# EAGLE schematic schichor_BP_schema (EAGLE 9.6.2)
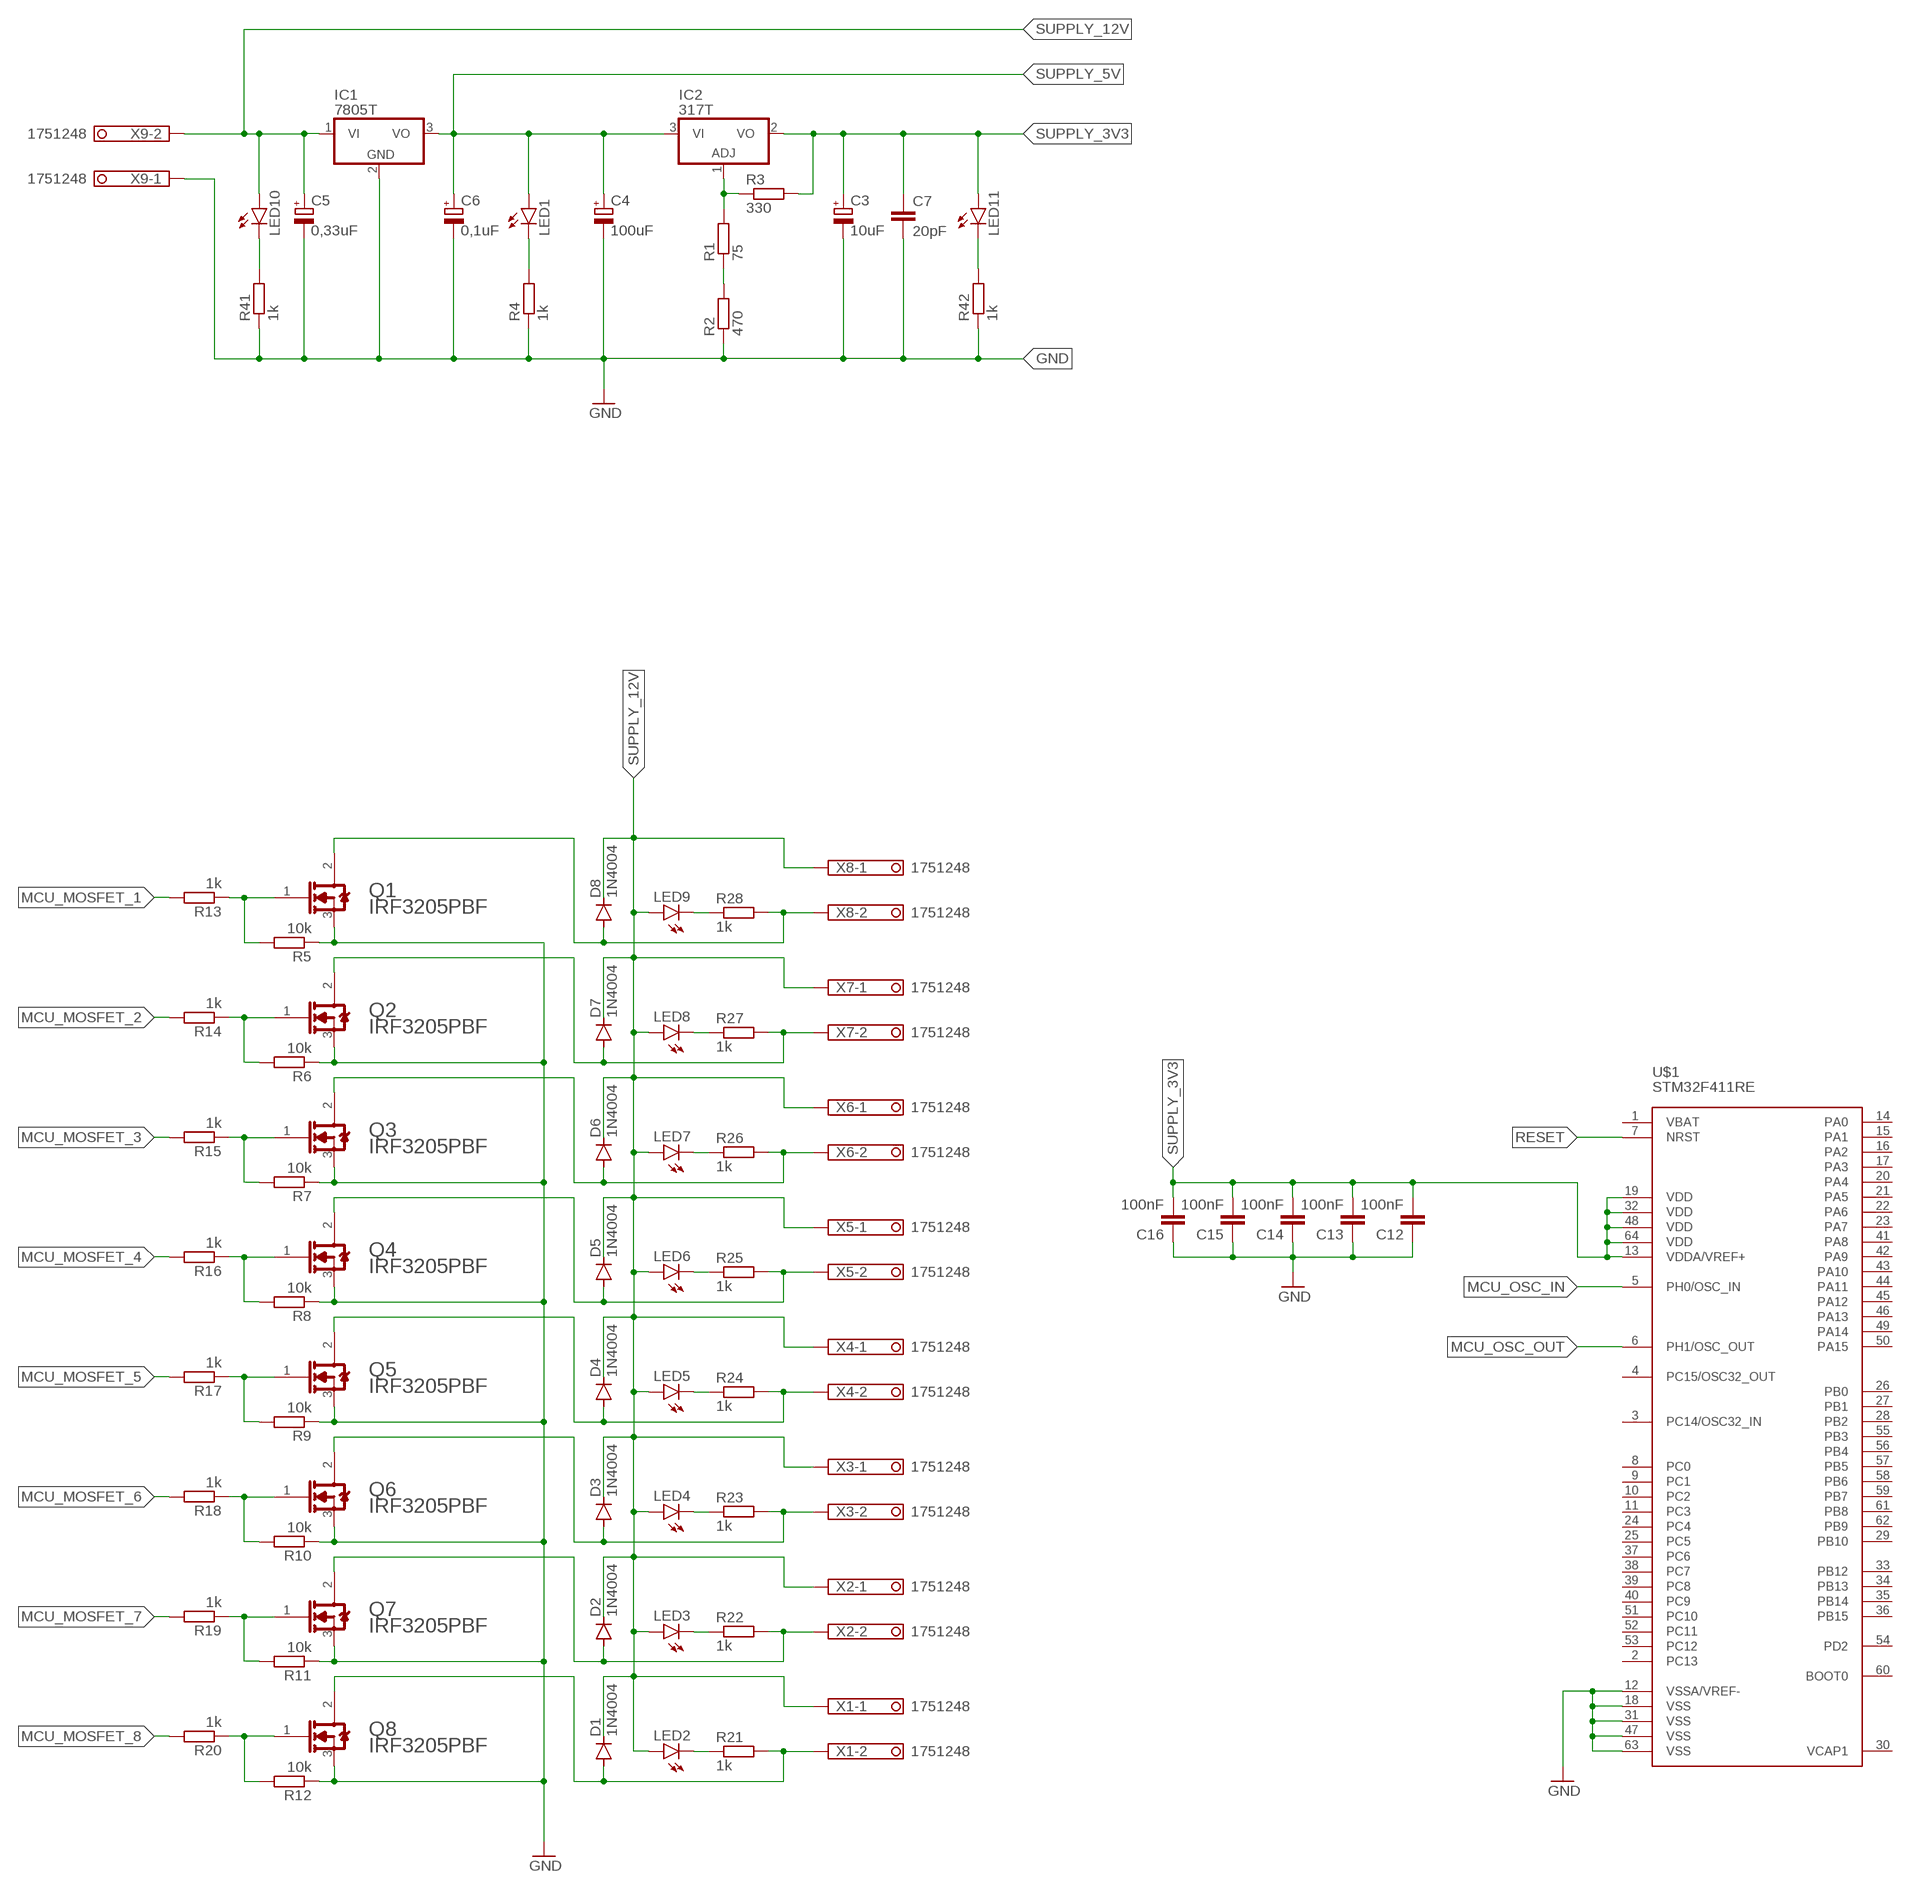
[diagram p0: schematic, sheet 1, part 1 of 2]
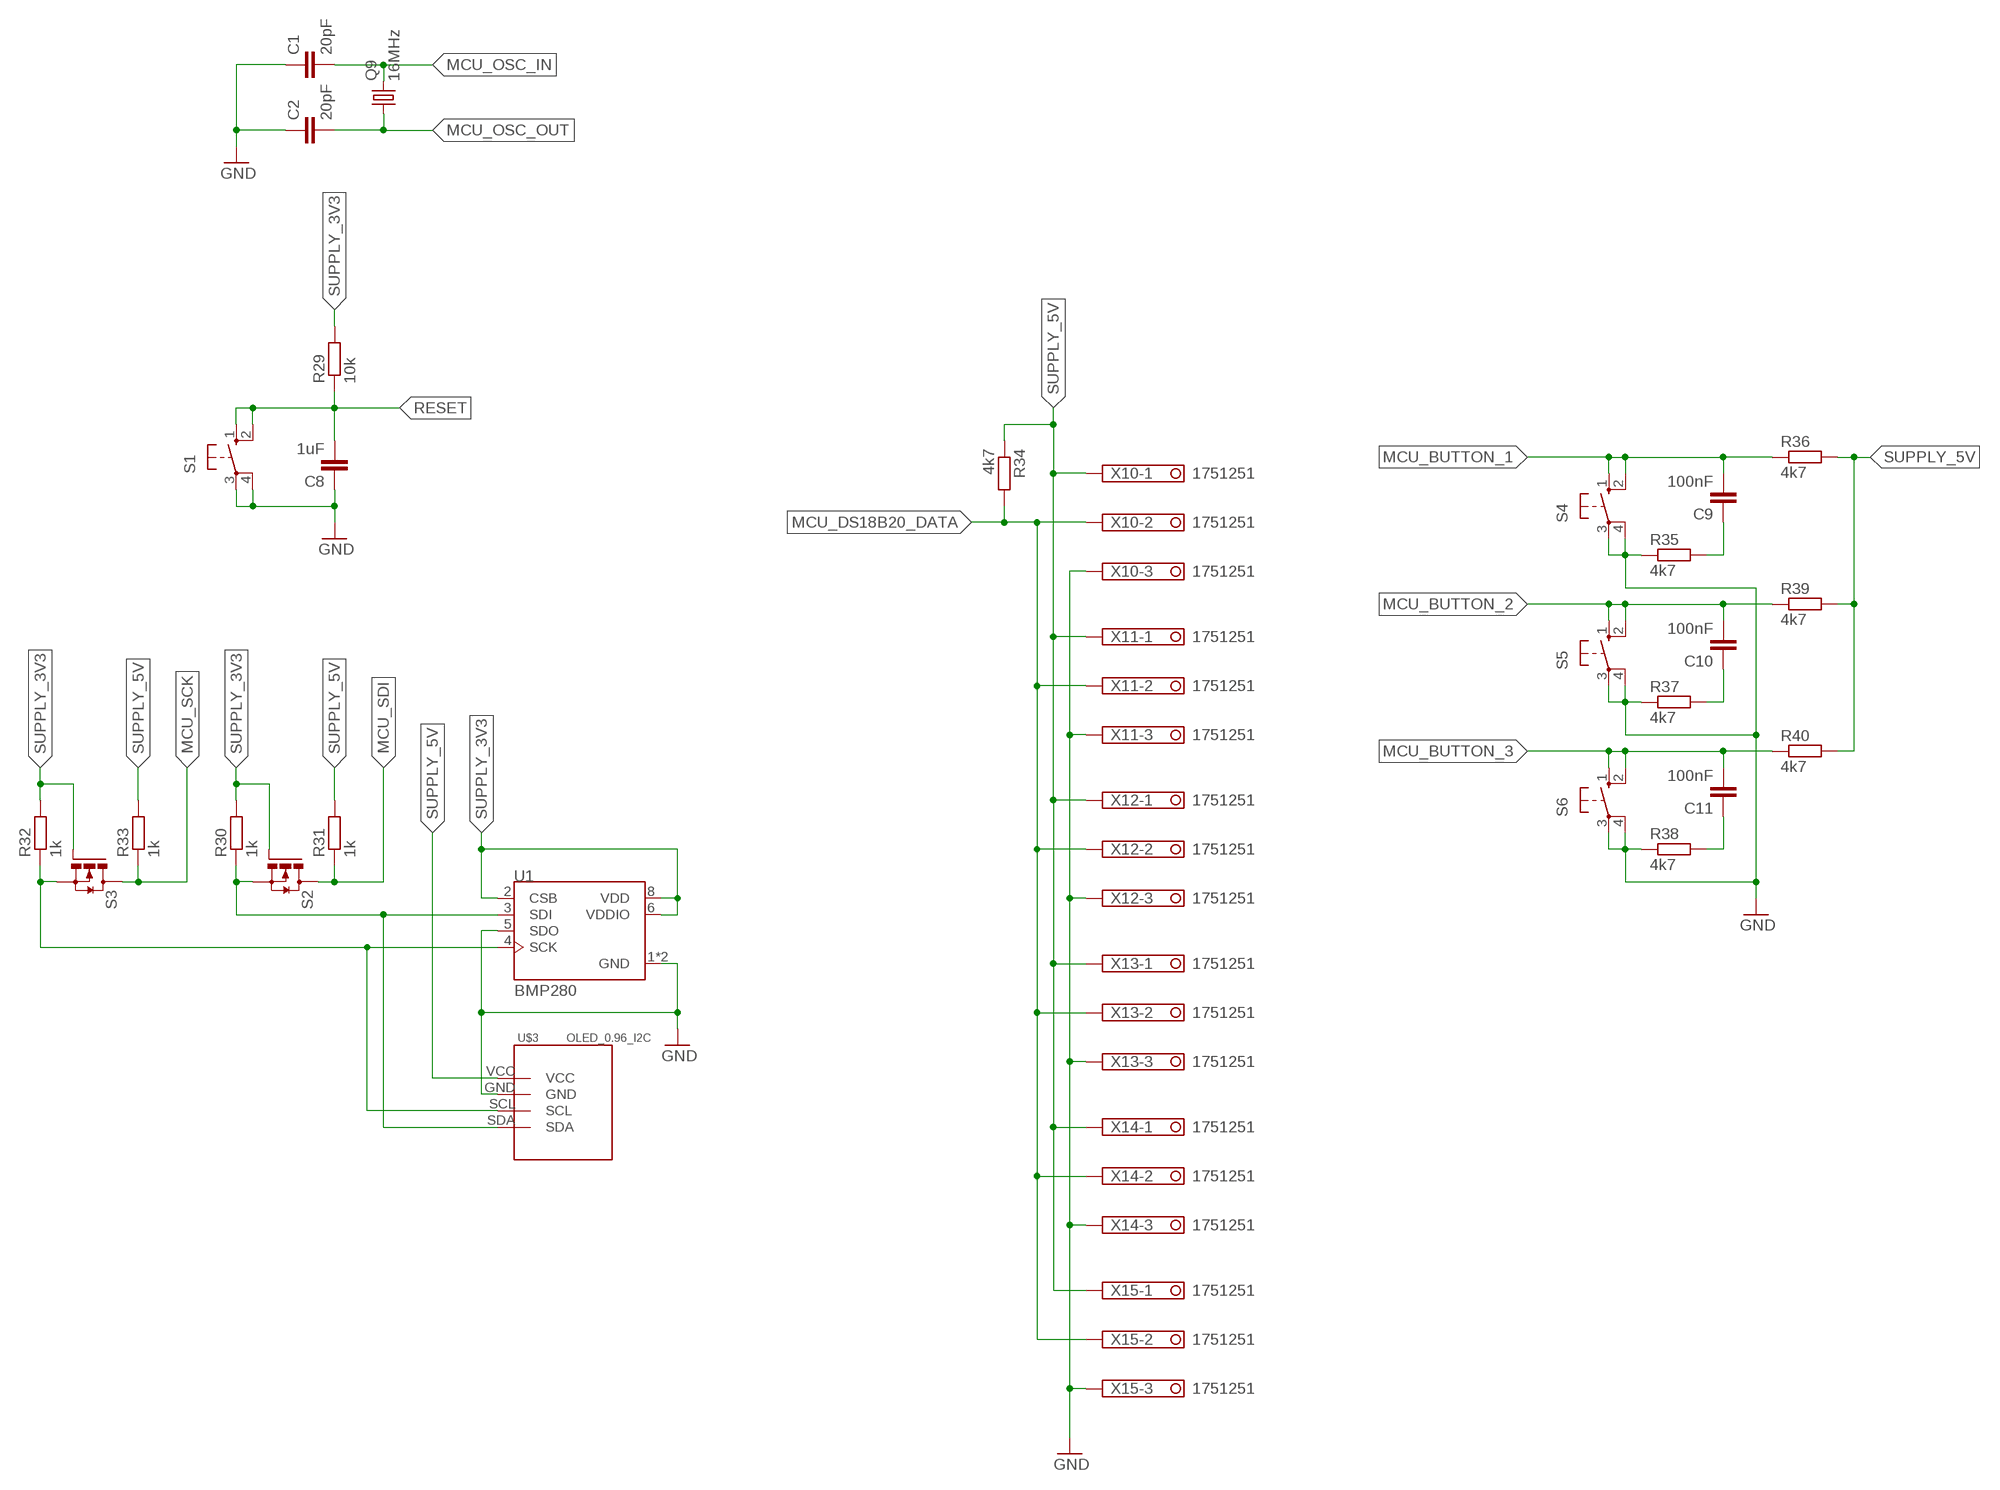
[diagram p1: schematic, sheet 1, part 2 of 2]

## Parts
C1  20pF  C-EUC0201  [C0201]
C2  20pF  C-EUC0201  [C0201]
C3  10uF  CPOL-EU085CS-1AR  [085CS_1AR]
C4  100uF  CPOL-EU085CS-1AR  [085CS_1AR]
C5  0,33uF  CPOL-EU085CS-1AR  [085CS_1AR]
C6  0,1uF  CPOL-EU085CS-1AR  [085CS_1AR]
C7  20pF  C-EUC0201  [C0201]
C8  1uF  C-EUC0201  [C0201]
C9  100nF  C-EUC0201  [C0201]
C10  100nF  C-EUC0201  [C0201]
C11  100nF  C-EUC0201  [C0201]
C12  100nF  C-EUC0201  [C0201]
C13  100nF  C-EUC0201  [C0201]
C14  100nF  C-EUC0201  [C0201]
C15  100nF  C-EUC0201  [C0201]
C16  100nF  C-EUC0201  [C0201]
D1  1N4004  [DO41-10]
D2  1N4004  [DO41-10]
D3  1N4004  [DO41-10]
D4  1N4004  [DO41-10]
D5  1N4004  [DO41-10]
D6  1N4004  [DO41-10]
D7  1N4004  [DO41-10]
D8  1N4004  [DO41-10]
IC1  7805T  [TO220H]
IC2  317T  [TO220H]
LED1  LED  [SMARTLED-TTW]
LED2  LED  [SMARTLED-TTW]
LED3  LED  [SMARTLED-TTW]
LED4  LED  [SMARTLED-TTW]
LED5  LED  [SMARTLED-TTW]
LED6  LED  [SMARTLED-TTW]
LED7  LED  [SMARTLED-TTW]
LED8  LED  [SMARTLED-TTW]
LED9  LED  [SMARTLED-TTW]
LED10  LED  [SMARTLED-TTW]
LED11  LED  [SMARTLED-TTW]
Q1  INFINEON_IRF3205PBFINFINEON_IRF3205PBF_0_0  [INFINEON_IRF3205PBF_0]
Q2  INFINEON_IRF3205PBFINFINEON_IRF3205PBF_0_0  [INFINEON_IRF3205PBF_0]
Q3  INFINEON_IRF3205PBFINFINEON_IRF3205PBF_0_0  [INFINEON_IRF3205PBF_0]
Q4  INFINEON_IRF3205PBFINFINEON_IRF3205PBF_0_0  [INFINEON_IRF3205PBF_0]
Q5  INFINEON_IRF3205PBFINFINEON_IRF3205PBF_0_0  [INFINEON_IRF3205PBF_0]
Q6  INFINEON_IRF3205PBFINFINEON_IRF3205PBF_0_0  [INFINEON_IRF3205PBF_0]
Q7  INFINEON_IRF3205PBFINFINEON_IRF3205PBF_0_0  [INFINEON_IRF3205PBF_0]
Q8  INFINEON_IRF3205PBFINFINEON_IRF3205PBF_0_0  [INFINEON_IRF3205PBF_0]
Q9  16MHz  CRYSTALHC49S  [HC49/S]
R1  75  R-EU_R1206  [R1206]
R2  470  R-EU_R1206  [R1206]
R3  330  R-EU_R1206  [R1206]
R4  1k  R-EU_R1206  [R1206]
R5  10k  R-EU_R1206  [R1206]
R6  10k  R-EU_R1206  [R1206]
R7  10k  R-EU_R1206  [R1206]
R8  10k  R-EU_R1206  [R1206]
R9  10k  R-EU_R1206  [R1206]
R10  10k  R-EU_R1206  [R1206]
R11  10k  R-EU_R1206  [R1206]
R12  10k  R-EU_R1206  [R1206]
R13  1k  R-EU_R1206  [R1206]
R14  1k  R-EU_R1206  [R1206]
R15  1k  R-EU_R1206  [R1206]
R16  1k  R-EU_R1206  [R1206]
R17  1k  R-EU_R1206  [R1206]
R18  1k  R-EU_R1206  [R1206]
R19  1k  R-EU_R1206  [R1206]
R20  1k  R-EU_R1206  [R1206]
R21  1k  R-EU_R1206  [R1206]
R22  1k  R-EU_R1206  [R1206]
R23  1k  R-EU_R1206  [R1206]
R24  1k  R-EU_R1206  [R1206]
R25  1k  R-EU_R1206  [R1206]
R26  1k  R-EU_R1206  [R1206]
R27  1k  R-EU_R1206  [R1206]
R28  1k  R-EU_R1206  [R1206]
R29  10k  R-EU_R1206  [R1206]
R30  1k  R-EU_R1206  [R1206]
R31  1k  R-EU_R1206  [R1206]
R32  1k  R-EU_R1206  [R1206]
R33  1k  R-EU_R1206  [R1206]
R34  4k7  R-EU_R1206  [R1206]
R35  4k7  R-EU_R1206  [R1206]
R36  4k7  R-EU_R1206  [R1206]
R37  4k7  R-EU_R1206  [R1206]
R38  4k7  R-EU_R1206  [R1206]
R39  4k7  R-EU_R1206  [R1206]
R40  4k7  R-EU_R1206  [R1206]
R41  1k  R-EU_R1206  [R1206]
R42  1k  R-EU_R1206  [R1206]
S1  10-XX  [B3F-10XX]
S2  2N7000  [TO-92EXPANDED]
S3  2N7000  [TO-92EXPANDED]
S4  10-XX  [B3F-10XX]
S5  10-XX  [B3F-10XX]
S6  10-XX  [B3F-10XX]
U1  BMP280  [XDCR_BMP280]
U$1  STM32F411RE  STM32F411XC  [LQFP64]
U$3  OLED_0.96_I2C  [OLED_0.96_I2C]
X1  1751248  [1751248]
X2  1751248  [1751248]
X3  1751248  [1751248]
X4  1751248  [1751248]
X5  1751248  [1751248]
X6  1751248  [1751248]
X7  1751248  [1751248]
X8  1751248  [1751248]
X9  1751248  [1751248]
X10  1751251  [1751251]
X11  1751251  [1751251]
X12  1751251  [1751251]
X13  1751251  [1751251]
X14  1751251  [1751251]
X15  1751251  [1751251]

## Nets
GND: C1.1 C2.1 C3.- C4.- C5.- C6.- C7.2 C8.1 C12.1 C13.1 C14.1 C15.1 C16.1 IC1.2(GND) Q1.3(SOURCE) Q2.3(SOURCE) Q3.3(SOURCE) Q4.3(SOURCE) Q5.3(SOURCE) Q6.3(SOURCE) Q7.3(SOURCE) Q8.3(SOURCE) R2.1 R4.1 R5.1 R6.1 R7.1 R8.1 R9.1 R10.1 R11.1 R12.1 R35.1 R37.1 R38.1 R41.1 R42.1 S1.3(P) S1.4(P1) S4.3(P) S4.4(P1) S5.3(P) S5.4(P1) S6.3(P) S6.4(P1) U1.1(GND) U1.5(SDO) U1.7(GND) U$1.12(VSSA/VREF-) U$1.18(VSS) U$1.31(VSS) U$1.47(VSS) U$1.63(VSS) U$3.GND X9.1 X10.3 X11.3 X12.3 X13.3 X14.3 X15.3
MCU_BUTTON_1: C9.2 R36.1 S4.1(S) S4.2(S1)
MCU_BUTTON_2: C10.2 R39.1 S5.1(S) S5.2(S1)
MCU_BUTTON_3: C11.2 R40.1 S6.1(S) S6.2(S1)
MCU_DS18B20_DATA: R34.2 X10.2 X11.2 X12.2 X13.2 X14.2 X15.2
MCU_MOSFET_1: R13.2
MCU_MOSFET_2: R14.2
MCU_MOSFET_3: R15.2
MCU_MOSFET_4: R16.2
MCU_MOSFET_5: R17.2
MCU_MOSFET_6: R18.2
MCU_MOSFET_7: R19.2
MCU_MOSFET_8: R20.2
MCU_OSC_IN: C1.2 Q9.2 U$1.5(PH0/OSC_IN)
MCU_OSC_OUT: C2.2 Q9.1 U$1.6(PH1/OSC_OUT)
MCU_SCK: R33.1 S3.1(D)
MCU_SDI: R31.1 S2.1(D)
N$1: R30.1 S2.3(S) U1.3(SDI) U$3.SDA
N$2: R32.1 S3.3(S) U1.4(SCK) U$3.SCL
N$4: LED10.C@1(C) R41.2
N$5: IC2.1(ADJ) R1.2 R3.1
N$6: C9.1 R35.2
N$7: LED11.C@1(C) R42.2
N$8: LED1.C@1(C) R4.2
N$9: Q1.1(GATE) R5.2 R13.1
N$10: R1.1 R2.2
N$11: Q8.1(GATE) R12.2 R20.1
N$12: Q7.1(GATE) R11.2 R19.1
N$13: Q6.1(GATE) R10.2 R18.1
N$14: Q5.1(GATE) R9.2 R17.1
N$15: Q4.1(GATE) R8.2 R16.1
N$16: Q2.1(GATE) R6.2 R14.1
N$17: Q3.1(GATE) R7.2 R15.1
N$18: D1.A Q8.2(DRAIN) R21.2 X1.2
N$19: D2.A Q7.2(DRAIN) R22.2 X2.2
N$20: LED2.C@1(C) R21.1
N$21: C10.1 R37.2
N$22: LED3.C@1(C) R22.1
N$24: D3.A Q6.2(DRAIN) R23.2 X3.2
N$25: LED4.C@1(C) R23.1
N$26: C11.1 R38.2
N$27: D4.A Q5.2(DRAIN) R24.2 X4.2
N$28: LED5.C@1(C) R24.1
N$30: D5.A Q4.2(DRAIN) R25.2 X5.2
N$31: LED6.C@1(C) R25.1
N$33: D6.A Q3.2(DRAIN) R26.2 X6.2
N$34: LED7.C@1(C) R26.1
N$36: D7.A Q2.2(DRAIN) R27.2 X7.2
N$37: LED8.C@1(C) R27.1
N$39: D8.A Q1.2(DRAIN) R28.2 X8.2
N$40: LED9.C@1(C) R28.1
RESET: C8.2 R29.1 S1.1(S) S1.2(S1) U$1.7(NRST)
SUPPLY_3V3: C3.+ C7.1 C12.2 C13.2 C14.2 C15.2 C16.2 IC2.2(VO) LED11.A@1(A) R3.2 R29.2 R30.2 R32.2 S2.2(G) S3.2(G) U1.2(CSB) U1.6(VDDIO) U1.8(VDD) U$1.13(VDDA/VREF+) U$1.19(VDD) U$1.32(VDD) U$1.48(VDD) U$1.64(VDD)
SUPPLY_5V: C4.+ C6.+ IC1.3(VO) IC2.3(VI) LED1.A@1(A) R31.2 R33.2 R34.1 R36.2 R39.2 R40.2 U$3.VCC X10.1 X11.1 X12.1 X13.1 X14.1 X15.1
SUPPLY_12V: C5.+ D1.C D2.C D3.C D4.C D5.C D6.C D7.C D8.C IC1.1(VI) LED2.A@1(A) LED3.A@1(A) LED4.A@1(A) LED5.A@1(A) LED6.A@1(A) LED7.A@1(A) LED8.A@1(A) LED9.A@1(A) LED10.A@1(A) X1.1 X2.1 X3.1 X4.1 X5.1 X6.1 X7.1 X8.1 X9.2
Unconnected: U$1.1(VBAT) U$1.2(PC13) U$1.3(PC14/OSC32_IN) U$1.4(PC15/OSC32_OUT) U$1.8(PC0) U$1.9(PC1) U$1.10(PC2) U$1.11(PC3) U$1.14(PA0) U$1.15(PA1) U$1.16(PA2) U$1.17(PA3) U$1.20(PA4) U$1.21(PA5) U$1.22(PA6) U$1.23(PA7) U$1.24(PC4) U$1.25(PC5) U$1.26(PB0) U$1.27(PB1) U$1.28(PB2) U$1.29(PB10) U$1.30(VCAP1) U$1.33(PB12) U$1.34(PB13) U$1.35(PB14) U$1.36(PB15) U$1.37(PC6) U$1.38(PC7) U$1.39(PC8) U$1.40(PC9) U$1.41(PA8) U$1.42(PA9) U$1.43(PA10) U$1.44(PA11) U$1.45(PA12) U$1.46(PA13) U$1.49(PA14) U$1.50(PA15) U$1.51(PC10) U$1.52(PC11) U$1.53(PC12) U$1.54(PD2) U$1.55(PB3) U$1.56(PB4) U$1.57(PB5) U$1.58(PB6) U$1.59(PB7) U$1.60(BOOT0) U$1.61(PB8) U$1.62(PB9)

## Library data of the parts
C1 C2 C7-C16 = rcl:C-EU: CAPACITOR, European symbol; SPICEPREFIX: C
C3-C6 = rcl:CPOL-EU: POLARIZED CAPACITOR, European symbol; SPICEPREFIX: C
D1-D8 = diode:1N4004: DIODE general purpose rectifier, 1 A
IC1 = linear:78*: Positive VOLTAGE REGULATOR Source: http://cache.national.com/ds/LM/LM78L05.pdf http://www.fairchildsemi.com/ds/LM/LM7805.pdf
IC2 = linear:*317: Positive VOLTAGE REGULATOR
LED1-LED11 = led:LED: LED OSRAM: - CHIPLED LG R971, LG N971, LY N971, LG Q971, LY Q971, LO R971, LY R971 LH N974, LH R974 LS Q976, LO Q976, LY Q976 LO Q996 - Hyper CHIPLED LW Q18S LB Q993, LB Q99A, LB R99A - SideLED LS A670, LO A670, LY A670, LG A670, LP A670 LB A673, LV A673, LT A673, LW A673 LH A674 LY A675 LS A676, LA A676, LO A676, LY A676, LW A676 LS A679, LY A679, LG A679 - Hyper Micro SIDELED® LS Y876, LA Y876, LO Y876, LY Y876 LT Y87S - SmartLED LW L88C, LW L88S LB L89C, LB L89S, LG L890 LS L89K, LO L89K, LY L89K LS L896, LA L896, LO L896, LY L896 - TOPLED LS T670, LO T670, LY T670, LG T670, LP T670 LSG T670, LSP T670, LSY T670, LOP T670, LYG T670 LG T671, LOG T671, LSG T671 LB T673, LV T673, LT T673, LW T673 LH T674 LS T676, LA T676, LO T676, LY T676, LB T676, LH T676, LSB T676, LW T676 LB T67C, LV T67C, LT T67C, LS T67K, LO T67K, LY T67K, LW E67C LS E67B, LA E67B, LO E67B, LY E67B, LB E67C, LV E67C, LT E67C LW T67C LS T679, LY T679, LG T679 LS T770, LO T770, LY T770, LG T770, LP T770 LB T773, LV T773, LT T773, LW T773 LH T774 LS E675, LA E675, LY E675, LS T675 LS T776, LA T776, LO T776, LY T776, LB T776 LHGB T686 LT T68C, LB T68C - Hyper Mini TOPLED® LB M676 - Mini TOPLED Santana® LG M470 LS M47K, LO M47K, LY M47K Source: http://www.osram.convergy.de LUXEON: - LUMILED® LXK2-PW12-R00, LXK2-PW12-S00, LXK2-PW14-U00, LXK2-PW14-V00 LXK2-PM12-R00, LXK2-PM12-S00, LXK2-PM14-U00 LXK2-PE12-Q00, LXK2-PE12-R00, LXK2-PE12-S00, LXK2-PE14-T00, LXK2-PE14-U00 LXK2-PB12-K00, LXK2-PB12-L00, LXK2-PB12-M00, LXK2-PB14-N00, LXK2-PB14-P00, LXK2-PB14-Q00 LXK2-PR12-L00, LXK2-PR12-M00, LXK2-PR14-Q00, LXK2-PR14-R00 LXK2-PD12-Q00, LXK2-PD12-R00, LXK2-PD12-S00 LXK2-PH12-R00, LXK2-PH12-S00 LXK2-PL12-P00, LXK2-PL12-Q00, LXK2-PL12-R00 Source: www.luxeon.com KINGBRIGHT: KA-3528ASYC Source: www.kingbright.com
Q1-Q8 = Infineon - IRF3205PBF:INFINEON_IRF3205PBF: MOSFET Transistor, N Channel, 110 A, 55 V, 8 mohm, 10 V, 4 V; CENTROID_NOT_SPECIFIED: No; CONTINUOUS_DRAIN_CURRENT: 110A; DATASHEET: https://www.infineon.com/dgdl/irf3205pbf.pdf?fileId=5546d462533600a4015355def244190a; DEVICE_CLASS_L1: Discrete Semiconductors; DEVICE_CLASS_L2: Transistors; DEVICE_CLASS_L3: MOSFETs; DIGIKEY_DESCRIPTION: TRANS MOSFET N-CH 55V 110A TO-220AB; DIGIKEY_PART_NUMBER: IRF3205PBF-ND; DRAIN_TO_SOURCE_BREAKDOWN_VOLTAGE: 55V; DRAIN_TO_SOURCE_RESISTANCE: 8mΩ; DRAIN_TO_SOURCE_VOLTAGE: 55V; FOOTPRINT_URL: https://www.infineon.com/dgdl/po-to220ab-fp.pdf?fileId=5546d462580663ef0158068cfbee01be; GATE_TO_SOURCE_VOLTAGE: 20V; HEIGHT: 19.8mm; INPUT_CAPACITACE_AT_VDS: 3247pF @ 25V; LEAD_FREE: yes; MAX_JUNCTION_TEMP: +175°C; MF: Infineon; MFG_PACKAGE_IDENT: PG-TO220-3; MFG_PACKAGE_IDENT_DATE: 0; MFG_PACKAGE_IDENT_REV: 904; MOUSER_DESCRIPTION: MOSFET MOSFT 55V 98A 8mOhm 97.3nC; MOUSER_PART_NUMBER: 942-IRF3205PBF; MPN: IRF3205PBF; NUMBER_OF_CHANNELS: 1; NUMBER_OF_N_CHANNELS: 1; PACKAGE: TO-220AB; POWER_DISSIPATION: 200W; PREFIX: Q; ROHS: yes; STANDOFF_HEIGHT: 3.37mm; TECHNOLOGY: MOSFET; TEMPERATURE_RANGE_HIGH: +175°C; TEMPERATURE_RANGE_LOW: -55°C; THRESHOLD_VGS: 2-4V; TURN_OFF_DELAY_TIME: 50ns; TURN_ON_DELAY_TIME: 14ns; VERIFICATION_VERSION: 0.0.0.1
Q9 = crystal:CRYSTAL: CRYSTAL; OC_FARNELL: 1667008; OC_NEWARK: unknown
R1-R42 = rcl:R-EU_: RESISTOR, European symbol; SPICEPREFIX: R
S1 S4-S6 = switch-omron:10-XX: OMRON SWITCH; MPN: B3F-1000; OC_FARNELL: 176432; OC_NEWARK: 36M3542
S2 S3 = 2N7000:2N7000: Check prices <https://pricing.snapeda.com/parts/2N7000/STMicroelectronics/view-part?ref=eda>; AVAILABILITY: In Stock; DESCRIPTION: N-Channel 60V 350mA (Tc) 1W (Tc) Through Hole TO-92-3; MF: STMicroelectronics; MP: 2N7000; PACKAGE: E-PKG AXIAL-LEADED-2 ON Semiconductor; PRICE: None; PURCHASE-URL: https://pricing.snapeda.com/search/part/2N7000/?ref=eda
U1 = BMP280:BMP280: BMP280 Absolute Barometric Pressure Sensor for Battery Powered Devices 2 x 2.5mm Check prices <https://pricing.snapeda.com/parts/BMP280/Bosch/view-part?ref=eda>; AVAILABILITY: In Stock; DESCRIPTION: Pressure Sensor 4.35PSI ~ 15.95PSI (30kPa ~ 110kPa) Absolute 16b 8-SMD; MF: Bosch; MP: BMP280; PACKAGE: LGA-8 Bosch Tools; PRICE: None
U$1 = stm32f411:STM32F411XC
U$3 = tft_1_8_1_44_oled_0_96:OLED_0.96_I2C
X1-X9 = con-phoenix-350:1751248: MKDS 1/ 2-3,5 Printklemme Nennstrom: 10 A Bemessungsspannung: 160 V Raster: 3,5 mm Polzahl: 2 Montageart: Löten Anschlussart: Schraubanschluss Anschlussrichtung vom Leiter zur Platine: 0° Source: http://eshop.phoenixcontact.com .. 1751248.pdf; OC_FARNELL: unknown; OC_NEWARK: unknown
X10-X15 = con-phoenix-350:1751251: MKDS 1/ 3-3,5 Printklemme Nennstrom: 10 A Bemessungsspannung: 160 V Raster: 3,5 mm Polzahl: 3 Montageart: Löten Anschlussart: Schraubanschluss Anschlussrichtung vom Leiter zur Platine: 0° Source: http://eshop.phoenixcontact.com .. 1751251.pdf; OC_FARNELL: unknown; OC_NEWARK: unknown